# EAGLE design v1 (EAGLE 9.6.2)
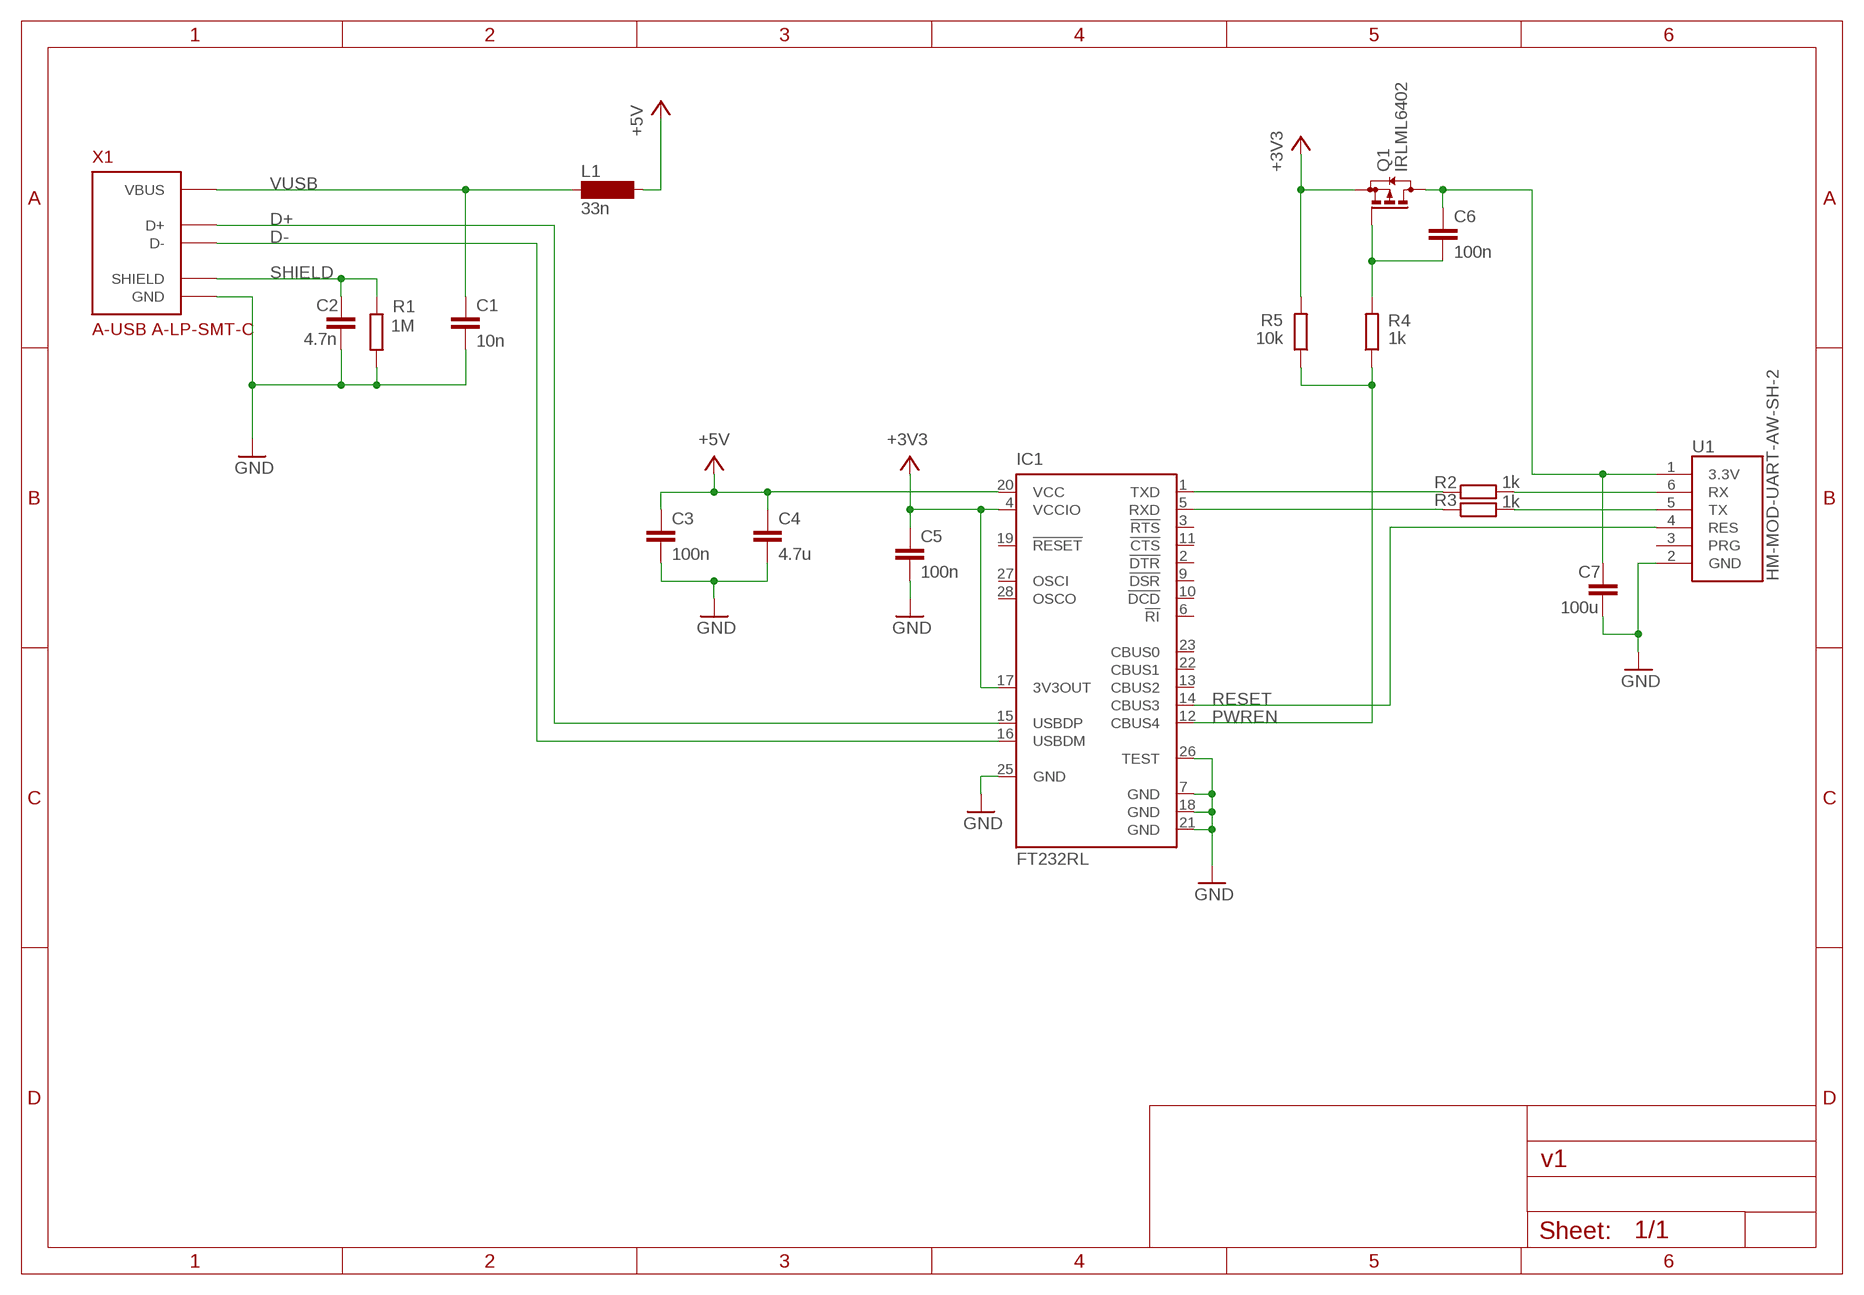
[diagram p0: schematic, sheet 1]

## Parts
C1  10n  C-EUC1206  [C1206]
C2  4.7n  C-EUC1206  [C1206]
C3  100n  C-EUC1206  [C1206]
C4  4.7u  C-EUC1206  [C1206]
C5  100n  C-EUC1206  [C1206]
C6  100n  C-EUC1206  [C1206]
C7  100u  C-EUC1206  [C1206]
IC1  FT232RL  [SSOP28]
L1  33n  SM-1206  [SM-1206]
Q1  IRLML6402  BSS84  [SOT23]
R1  1M  R-EU_R1206  [R1206]
R2  1k  R-EU_R1206  [R1206]
R3  1k  R-EU_R1206  [R1206]
R4  1k  R-EU_R1206  [R1206]
R5  10k  R-EU_R1206  [R1206]
U1  HM-MOD-UART-AW-SH-2  HM-MOD-UART-AW-SH-2_SMD  [HM-MOD-UART-AW-SH-2_SMD]
X1  A-USB A-LP-SMT-C  USB-1.0/1.1/2.0-STANDARD-A/B_A-LP-SMT-C  [A-USB_A-LP-SMT-C]

## Nets
+3V3: C5.1 IC1.4(VCCIO) IC1.17(3V3OUT) Q1.2(S) R5.2
+5V: C3.1 C4.1 IC1.20(VCC) L1.2
D+: IC1.15(USBDP) X1.3(D+)
D-: IC1.16(USBDM) X1.2(D-)
GND: C1.2 C2.2 C3.2 C4.2 C5.2 C7.2 IC1.7(GND) IC1.18(GND) IC1.21(GND) IC1.25(GND) IC1.26(TEST) R1.2 U1.2(GND) X1.4(GND)
N$3: C6.1 C7.1 Q1.3(D) U1.1(3.3V)
N$4: R2.2 U1.6(RX)
N$5: R3.2 U1.5(TX)
N$6: IC1.1(TXD) R2.1
N$7: IC1.5(RXD) R3.1
N$8: C6.2 Q1.1(G) R4.2
PWREN: IC1.12(CBUS4) R4.1 R5.1
RESET: IC1.14(CBUS3) U1.4(RES)
SHIELD: C2.1 R1.1 X1.S1(SHIELD) X1.S2(SHIELD)
VUSB: C1.1 L1.1 X1.1(VBUS)
Unconnected: IC1.2(!DTR) IC1.3(!RTS) IC1.6(!RI) IC1.9(!DSR) IC1.10(!DCD) IC1.11(!CTS) IC1.13(CBUS2) IC1.19(!RESET) IC1.22(CBUS1) IC1.23(CBUS0) IC1.27(OSCI) IC1.28(OSCO) U1.3(PRG)

## Library data of the parts
C1-C7 = rcl:C-EU: CAPACITOR, European symbol; SPICEPREFIX: C
IC1 = ftdichip:FT232R: Source: http://www.ftdichip.com/Documents/DataSheets/DS_FT232R_v104.pdf; MPN: FT232RL; OC_FARNELL: 1146032; OC_NEWARK: 91K9918
L1 = inductor-neosid:SM-1206: INDUCTOR SMD chip inductor; OC_FARNELL: unknown; OC_NEWARK: unknown
Q1 = transistor-small-signal:BSS84: P-CHANNEL MOS FET
R1-R5 = rcl:R-EU_: RESISTOR, European symbol; SPICEPREFIX: R
U1 = homematic:HM-MOD-UART-AW-SH-2: HM-MOD-UART-AW-SH-2
X1 = dersimn_connector:USB-1.0/1.1/2.0-STANDARD-A/B

## Board
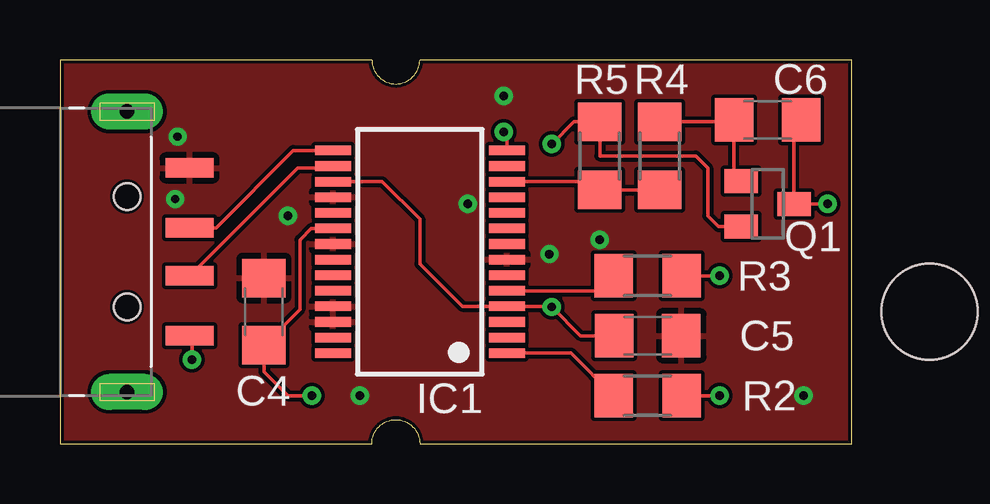
[diagram p1: board, top side]
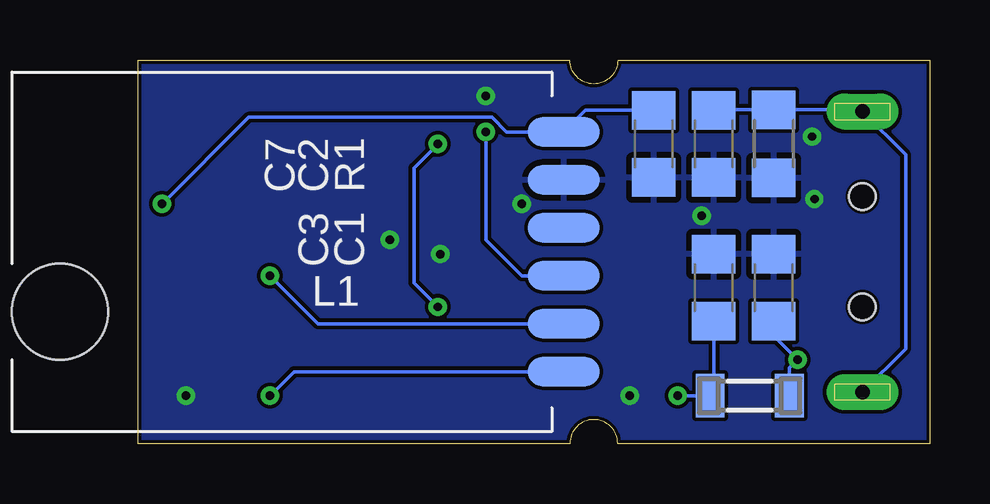
[diagram p2: board, bottom side, seen from below]

Size 33 x 16 mm. Coordinates in mm from the lower left corner, seen from the top.
Outline: 0,0 13,0 arc-180 15,0 33,0 33,16 15,16 arc-180 13,16 0,16 0,0
Copper layers (1*16): Top 0.035mm / dielectric 1.5mm / Bottom 0.035mm
Design rules "default *": minimum track width 6mil, minimum drill 0.35mm, track to track 6mil, track to pad 6mil, pad to pad 6mil, via to via 6mil, smd to smd 6mil, copper to edge 0.15mm, drill to drill 0.15mm, minimum pad ring 10mil, minimum via ring 8mil, stop-mask expansion 4mil, vias tented up to drill 0.35mm, thermal gap 10mil

### Footprints (pad centres in the part's own frame; a part is rotated, then mirrored left to right if it is on the bottom)
C1206 = smd 1.6 x 1.8: 1 -1.4,0; 2 1.4,0
SSOP28 = smd 0.4 x 1.5: 1 -4.225,-3.625; 2 -3.575,-3.625; 3 -2.925,-3.625; 4 -2.275,-3.625; 5 -1.625,-3.625; 6 -0.975,-3.625; 7 -0.325,-3.625; 8 0.325,-3.625; 9 0.975,-3.625; 10 1.625,-3.625; 11 2.275,-3.625; 12 2.925,-3.625; 13 3.575,-3.625; 14 4.225,-3.625; 15 4.225,3.625; 16 3.575,3.625; 17 2.925,3.625; 18 2.275,3.625; 19 1.625,3.625; 20 0.975,3.625; 21 0.325,3.625; 22 -0.325,3.625; 23 -0.975,3.625; 24 -1.625,3.625; 25 -2.275,3.625; 26 -2.925,3.625; 27 -3.575,3.625; 28 -4.225,3.625
SM-1206 = smd 1.2 x 1.8: 1 -1.65,0; 2 1.65,0
SOT23 = smd 1 x 1.4: 1 -0.95,-1.1; 2 0.95,-1.1; 3 0,1.1
R1206 = smd 1.6 x 1.803: 1 -1.422,0; 2 1.422,0
HM-MOD-UART-AW-SH-2_SMD = smd 3 x 1.2: 1 -0.5,2.5; 2 -0.5,4.5; 3 -0.5,6.5; 4 -0.5,8.5; 5 -0.5,10.5; 6 -0.5,12.5 | hole 4: 20.5,10
A-USB_A-LP-SMT-C = smd 2 x 0.8: 1 5.4,-3.5; 2 5.4,-1; 3 5.4,1; 4 5.4,3.5 | drill 0.6 pad 1.5 long: S1 2.8,5.85; S2 2.8,-5.85 | hole 1.1: 2.8,2.3; 2.8,-2.3

### Placement (x,y rotation side)
C1  6.5,6.5 90 bottom
C2  9,12.5 270 bottom
C3  9,6.5 90 bottom
C4  8.5,5.5 90 top
C5  24.5,4.5 0 top
C6  29.5,13.5 180 top
C7  11.5,12.5 270 bottom
IC1  15,8 90 top
L1  7.5,2 180 bottom
Q1  29.5,10 270 top
R1  6.5,12.5 270 bottom
R2  24.5,2 0 top
R3  24.5,7 0 top
R4  25,12 90 top
R5  22.5,12 90 top
U1  15.75,15.5 180 bottom
X1  0,8 0 top

### Tracks (layer width: path | path; a pad name or v marks a point on that pad's centre or on a via)
+3V3  (via drill 0.35)
  Top 0.152: Q1.2 27.45,9.05 27,9.5 27,11.5 26.5,12 22.5,12 R5.2 21.42,13.42 v20.5,12.5 | IC1.17 13.43,10.93 15,9.36 15,7.5 16.77,5.72 IC1.4 20.48,5.72 v20.5,5.7 21.7,4.5 C5.1
  Bottom 0.152: v20.5,5.7 21.5,6.7 21.5,11.5 v20.5,12.5
+5V  (via drill 0.35)
  Top 0.152: IC1.20 10.47,8.97 10,8.5 10,5.6 C4.1 8.5,3 9.5,2 v10.5,2
  Bottom 0.152: C3.1 9,2.15 L1.2 v10.5,2
D+
  Top 0.152: X1.3 6.5,9 9.72,12.22 IC1.15
D-
  Top 0.152: IC1.16 11.3,11.5 9.9,11.5 X1.2
GND  (via drill 0.35)
  other vias: 12.5,2 18.5,14.5 22.5,8.5 31,2 4.8,10.2 4.9,12.8 9.5,9.5 17,10 20.4,7.9
  pour Top: 0,16 0,0 33,0 33,16
  pour Bottom: 0,16 0,0 33,0 33,16
N$3  (via drill 0.35)
  Top 0.152: C6.1 30.6,13.2 Q1.3 v32,10
  Bottom 0.152: C7.1 14.35,13.9 U1.1 17.64,13 18.25,13.61 28.39,13.61 v32,10
N$4  (via drill 0.35)
  Top 0.152: 25.5,2 R2.2 v27.5,2
  Bottom 0.152: U1.6 26.5,3 v27.5,2
N$5  (via drill 0.35)
  Top 0.152: 25.92,6.42 R3.2 v27.5,7
  Bottom 0.152: U1.5 25.5,5 v27.5,7
N$6
  Top 0.152: IC1.1 21.3,3.77 R2.1
N$7
  Top 0.152: IC1.5 22.45,6.38 R3.1
N$8
  Top 0.152: Q1.1 28.1,11.25 C6.2 28.02,13.42 R4.2
PWREN
  Top 0.152: IC1.12 22.15,10.93 R5.1 R4.1
RESET  (via drill 0.35)
  Top 0.152: v18.5,13 18.62,12.88 IC1.14
  Bottom 0.152: U1.4 17,7 18.5,8.5 v18.5,13
SHIELD
  Bottom 0.152: X1.S2 1,3.95 1,12.05 X1.S1 2.87,13.92 R1.1 8.98,13.92 C2.1
VUSB  (via drill 0.35)
  Top 0.152: X1.1 5.5,4.4 v5.5,3.5
  Bottom 0.152: L1.1 5.85,3.15 v5.5,3.5 6.5,4.5 C1.1